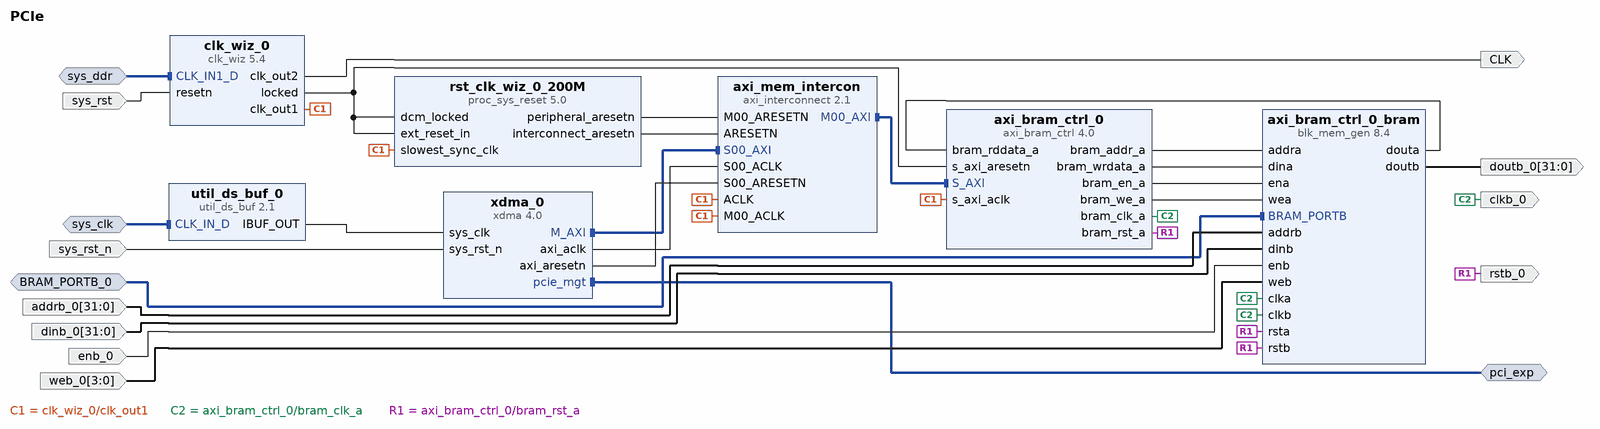
[diagram p0: block diagram of the top level]
# Vivado block design PCIe, xcku040-ffva1156-2-e, Vivado 2017.4
create_bd_design PCIe

create_bd_intf_port -mode Slave -vlnv xilinx.com:interface:diff_clock_rtl:1.0 sys_clk
create_bd_intf_port -mode Master -vlnv xilinx.com:interface:pcie_7x_mgt_rtl:1.0 pci_exp
create_bd_intf_port -mode Slave -vlnv xilinx.com:interface:diff_clock_rtl:1.0 sys_ddr
set_property -dict {CONFIG.FREQ_HZ 200000000} [get_bd_intf_ports sys_ddr]
create_bd_intf_port -mode Slave -vlnv xilinx.com:interface:bram_rtl:1.0 BRAM_PORTB_0
set_property -dict {CONFIG.MASTER_TYPE BRAM_CTRL} [get_bd_intf_ports BRAM_PORTB_0]
create_bd_port -dir I -type rst sys_rst_n
set_property -dict {CONFIG.POLARITY ACTIVE_LOW} [get_bd_ports sys_rst_n]
create_bd_port -dir I -type rst sys_rst
set_property -dict {CONFIG.POLARITY ACTIVE_LOW} [get_bd_ports sys_rst]
create_bd_port -dir I -from 31 -to 0 addrb_0
create_bd_port -dir I -from 31 -to 0 dinb_0
create_bd_port -dir O -from 31 -to 0 doutb_0
create_bd_port -dir I enb_0
create_bd_port -dir I -from 3 -to 0 web_0
create_bd_port -dir O -type clk clkb_0
create_bd_port -dir O -type rst rstb_0
create_bd_port -dir O CLK

create_bd_cell -type ip -vlnv xilinx.com:ip:axi_bram_ctrl:4.0 axi_bram_ctrl_0
set_property -dict {CONFIG.SINGLE_PORT_BRAM 1} [get_bd_cells axi_bram_ctrl_0]
create_bd_cell -type ip -vlnv xilinx.com:ip:blk_mem_gen:8.4 axi_bram_ctrl_0_bram
set_property -dict [list \
  CONFIG.Memory_Type True_Dual_Port_RAM \
  CONFIG.Assume_Synchronous_Clk true \
  CONFIG.Enable_B Use_ENB_Pin \
  CONFIG.Use_RSTB_Pin true \
  CONFIG.Port_B_Clock 100 \
  CONFIG.Port_B_Write_Rate 50 \
  CONFIG.Port_B_Enable_Rate 100 \
] [get_bd_cells axi_bram_ctrl_0_bram]
create_bd_cell -type ip -vlnv xilinx.com:ip:axi_interconnect:2.1 axi_mem_intercon
set_property -dict [list \
  CONFIG.NUM_MI 1 \
  CONFIG.ENABLE_ADVANCED_OPTIONS 1 \
  CONFIG.XBAR_DATA_WIDTH 256 \
  CONFIG.SYNCHRONIZATION_STAGES 2 \
] [get_bd_cells axi_mem_intercon]
create_bd_cell -type ip -vlnv xilinx.com:ip:clk_wiz:5.4 clk_wiz_0
set_property -dict [list \
  CONFIG.PRIM_IN_FREQ 200.000 \
  CONFIG.CLKIN1_JITTER_PS 50.0 \
  CONFIG.CLKOUT2_USED true \
  CONFIG.NUM_OUT_CLKS 2 \
  CONFIG.CLKOUT1_REQUESTED_OUT_FREQ 200.000 \
  CONFIG.CLKOUT2_REQUESTED_OUT_FREQ 200.000 \
  CONFIG.PRIM_SOURCE Differential_clock_capable_pin \
  CONFIG.CLKOUT1_DRIVES BUFG \
  CONFIG.CLKOUT2_DRIVES BUFG \
  CONFIG.CLKOUT3_DRIVES Buffer \
  CONFIG.CLKOUT4_DRIVES Buffer \
  CONFIG.CLKOUT5_DRIVES Buffer \
  CONFIG.CLKOUT6_DRIVES Buffer \
  CONFIG.CLKOUT7_DRIVES Buffer \
  CONFIG.RESET_PORT resetn \
  CONFIG.MMCM_DIVCLK_DIVIDE 1 \
  CONFIG.MMCM_CLKFBOUT_MULT_F 5.000 \
  CONFIG.MMCM_CLKIN1_PERIOD 5.000 \
  CONFIG.MMCM_CLKIN2_PERIOD 10.0 \
  CONFIG.MMCM_COMPENSATION AUTO \
  CONFIG.MMCM_CLKOUT0_DIVIDE_F 5.000 \
  CONFIG.MMCM_CLKOUT1_DIVIDE 5 \
  CONFIG.RESET_TYPE ACTIVE_LOW \
  CONFIG.CLKOUT1_JITTER 98.146 \
  CONFIG.CLKOUT1_PHASE_ERROR 89.971 \
  CONFIG.CLKOUT2_JITTER 98.146 \
  CONFIG.CLKOUT2_PHASE_ERROR 89.971 \
] [get_bd_cells clk_wiz_0]
create_bd_cell -type ip -vlnv xilinx.com:ip:proc_sys_reset:5.0 rst_clk_wiz_0_200M
create_bd_cell -type ip -vlnv xilinx.com:ip:util_ds_buf:2.1 util_ds_buf_0
set_property -dict {CONFIG.C_SIZE 1 CONFIG.C_BUF_TYPE IBUFDSGTE} [get_bd_cells util_ds_buf_0]
create_bd_cell -type ip -vlnv xilinx.com:ip:xdma:4.0 xdma_0
set_property -dict [list \
  CONFIG.mode_selection Advanced \
  CONFIG.pl_link_cap_max_link_width X4 \
  CONFIG.pl_link_cap_max_link_speed 5.0_GT/s \
  CONFIG.axi_data_width 128_bit \
  CONFIG.axisten_freq 125 \
  CONFIG.en_ext_ch_gt_drp false \
  CONFIG.pf0_device_id 7024 \
  CONFIG.pf0_class_code_base 05 \
  CONFIG.pf0_sub_class_interface_menu Generic_XT_compatible_serial_controller \
  CONFIG.pf0_class_code_sub 80 \
  CONFIG.pf0_class_code_interface 00 \
  CONFIG.axilite_master_en false \
  CONFIG.xdma_rnum_chnl 2 \
  CONFIG.xdma_wnum_chnl 2 \
  CONFIG.xdma_axilite_slave false \
  CONFIG.plltype QPLL1 \
  CONFIG.xdma_pcie_64bit_en false \
  CONFIG.barlite2 0 \
  CONFIG.PF0_DEVICE_ID_mqdma 9024 \
  CONFIG.PF2_DEVICE_ID_mqdma 9024 \
  CONFIG.PF3_DEVICE_ID_mqdma 9024 \
] [get_bd_cells xdma_0]

# ---- connections ----

connect_bd_intf_net [get_bd_intf_pins xdma_0/M_AXI] [get_bd_intf_pins axi_mem_intercon/S00_AXI]
connect_bd_intf_net [get_bd_intf_pins axi_mem_intercon/M00_AXI] [get_bd_intf_pins axi_bram_ctrl_0/S_AXI]
connect_bd_intf_net [get_bd_intf_ports sys_clk] [get_bd_intf_pins util_ds_buf_0/CLK_IN_D]
connect_bd_intf_net [get_bd_intf_ports pci_exp] [get_bd_intf_pins xdma_0/pcie_mgt]
connect_bd_intf_net [get_bd_intf_ports sys_ddr] [get_bd_intf_pins clk_wiz_0/CLK_IN1_D]
connect_bd_intf_net -intf_net BRAM_PORTB_0_1 [get_bd_intf_ports BRAM_PORTB_0] [get_bd_intf_pins axi_bram_ctrl_0_bram/BRAM_PORTB]
connect_bd_net [get_bd_ports sys_rst_n] [get_bd_pins xdma_0/sys_rst_n]
connect_bd_net [get_bd_pins util_ds_buf_0/IBUF_OUT] [get_bd_pins xdma_0/sys_clk]
connect_bd_net [get_bd_ports sys_rst] [get_bd_pins clk_wiz_0/resetn]
connect_bd_net [get_bd_pins clk_wiz_0/clk_out1] \
  [get_bd_pins axi_bram_ctrl_0/s_axi_aclk] [get_bd_pins axi_mem_intercon/ACLK] [get_bd_pins axi_mem_intercon/M00_ACLK] \
  [get_bd_pins rst_clk_wiz_0_200M/slowest_sync_clk]
connect_bd_net [get_bd_pins clk_wiz_0/locked] \
  [get_bd_pins axi_bram_ctrl_0/s_axi_aresetn] [get_bd_pins rst_clk_wiz_0_200M/ext_reset_in] \
  [get_bd_pins rst_clk_wiz_0_200M/dcm_locked]
connect_bd_net [get_bd_pins rst_clk_wiz_0_200M/peripheral_aresetn] [get_bd_pins axi_mem_intercon/M00_ARESETN]
connect_bd_net [get_bd_pins xdma_0/axi_aclk] [get_bd_pins axi_mem_intercon/S00_ACLK]
connect_bd_net [get_bd_pins xdma_0/axi_aresetn] [get_bd_pins axi_mem_intercon/S00_ARESETN]
connect_bd_net [get_bd_pins rst_clk_wiz_0_200M/interconnect_aresetn] [get_bd_pins axi_mem_intercon/ARESETN]
connect_bd_net -net addrb_0_1 [get_bd_ports addrb_0] [get_bd_pins axi_bram_ctrl_0_bram/addrb]
connect_bd_net -net dinb_0_1 [get_bd_ports dinb_0] [get_bd_pins axi_bram_ctrl_0_bram/dinb]
connect_bd_net [get_bd_pins axi_bram_ctrl_0_bram/doutb] [get_bd_ports doutb_0]
connect_bd_net -net enb_0_1 [get_bd_ports enb_0] [get_bd_pins axi_bram_ctrl_0_bram/enb]
connect_bd_net -net web_0_1 [get_bd_ports web_0] [get_bd_pins axi_bram_ctrl_0_bram/web]
connect_bd_net [get_bd_pins axi_bram_ctrl_0/bram_addr_a] [get_bd_pins axi_bram_ctrl_0_bram/addra]
connect_bd_net [get_bd_pins axi_bram_ctrl_0/bram_wrdata_a] [get_bd_pins axi_bram_ctrl_0_bram/dina]
connect_bd_net [get_bd_pins axi_bram_ctrl_0_bram/douta] [get_bd_pins axi_bram_ctrl_0/bram_rddata_a]
connect_bd_net [get_bd_pins axi_bram_ctrl_0/bram_en_a] [get_bd_pins axi_bram_ctrl_0_bram/ena]
connect_bd_net [get_bd_pins axi_bram_ctrl_0/bram_we_a] [get_bd_pins axi_bram_ctrl_0_bram/wea]
connect_bd_net [get_bd_pins axi_bram_ctrl_0/bram_clk_a] \
  [get_bd_ports clkb_0] [get_bd_pins axi_bram_ctrl_0_bram/clka] [get_bd_pins axi_bram_ctrl_0_bram/clkb]
connect_bd_net [get_bd_pins axi_bram_ctrl_0/bram_rst_a] \
  [get_bd_ports rstb_0] [get_bd_pins axi_bram_ctrl_0_bram/rsta] [get_bd_pins axi_bram_ctrl_0_bram/rstb]
connect_bd_net [get_bd_pins clk_wiz_0/clk_out2] [get_bd_ports CLK]

# ---- address map ----
assign_bd_address -offset 0x0000000000000000 -range 8K -target_address_space [get_bd_addr_spaces xdma_0/M_AXI] [get_bd_addr_segs axi_bram_ctrl_0/S_AXI/Mem0]

validate_bd_design
save_bd_design
